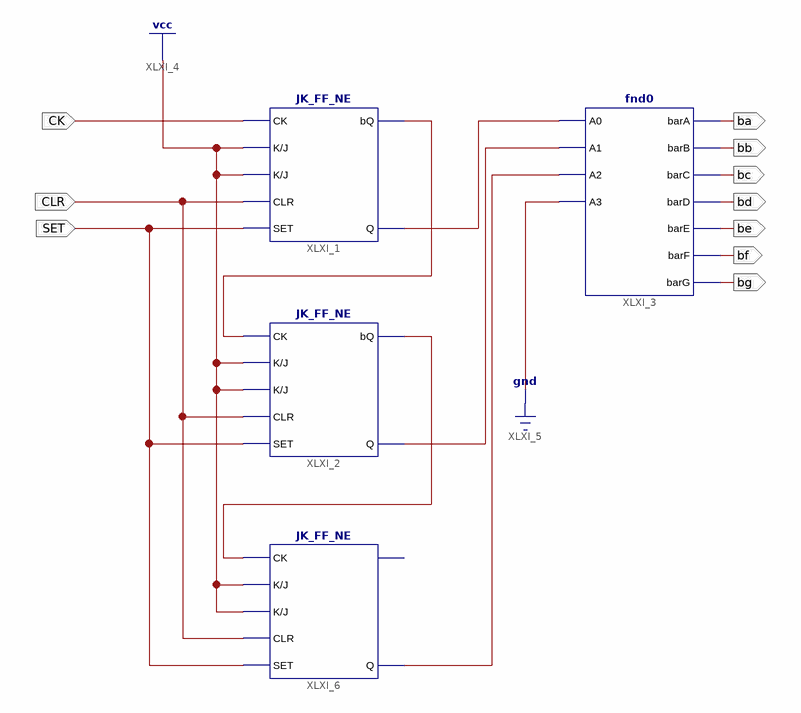
[diagram p0: schematic sheet 1]
// Xilinx ISE schematic Mod4_A1.sch (spartan6) as structural Verilog: 4 symbols, 10 ports
module Mod4_A1 (
  input  CK,
  input  CLR,
  input  SET,
  output ba,
  output bb,
  output bc,
  output bd,
  output be,
  output bf,
  output bg
);

  wire XLXN_31, XLXN_34, XLXN_35, XLXN_36, XLXN_38;

  JK_FF_NE XLXI_1 (.CK(CK), .K(1'b1), .J(1'b1), .CLR(CLR), .SET(SET), .bQ(XLXN_36), .Q(XLXN_34));
  JK_FF_NE XLXI_2 (.CK(XLXN_36), .K(1'b1), .J(1'b1), .CLR(CLR), .SET(SET), .bQ(XLXN_38), .Q(XLXN_35));
  fnd0 XLXI_3 (
    .A3(1'b0), .A2(XLXN_31), .A1(XLXN_35), .A0(XLXN_34), .barA(ba), .barB(bb), .barC(bc), .barD(bd),
    .barE(be), .barF(bf), .barG(bg));
  JK_FF_NE XLXI_6 (.CK(XLXN_38), .K(1'b1), .J(1'b1), .CLR(CLR), .SET(SET), .Q(XLXN_31));  // open: bQ
endmodule
